# Altium schematic sheet Fastino.schdoc: Fastino v1.2
size 420 x 297 mm; EDA_Number: ARTIQ; Projet: Fastino; Author: G.Kasprowicz; CompanyName: WUT ISE; DrawnBy: G.Kasprowicz; Organization: WUT ISE; Address1: PW ISE; Address2: Nowowiejska 15/19 00-665 Warsaw; Address3: gkasprow@gmail.com; DocumentNumber: 1; Revision: 2; SheetNumber: 1; SheetTotal: 8; ModifiedBy: -; CheckedDate: -; Title2: Top; DivGrp: WUT ISE; Designer: G.Kasprowicz; ModifiedDate: -; ProjectName: Sensor Box
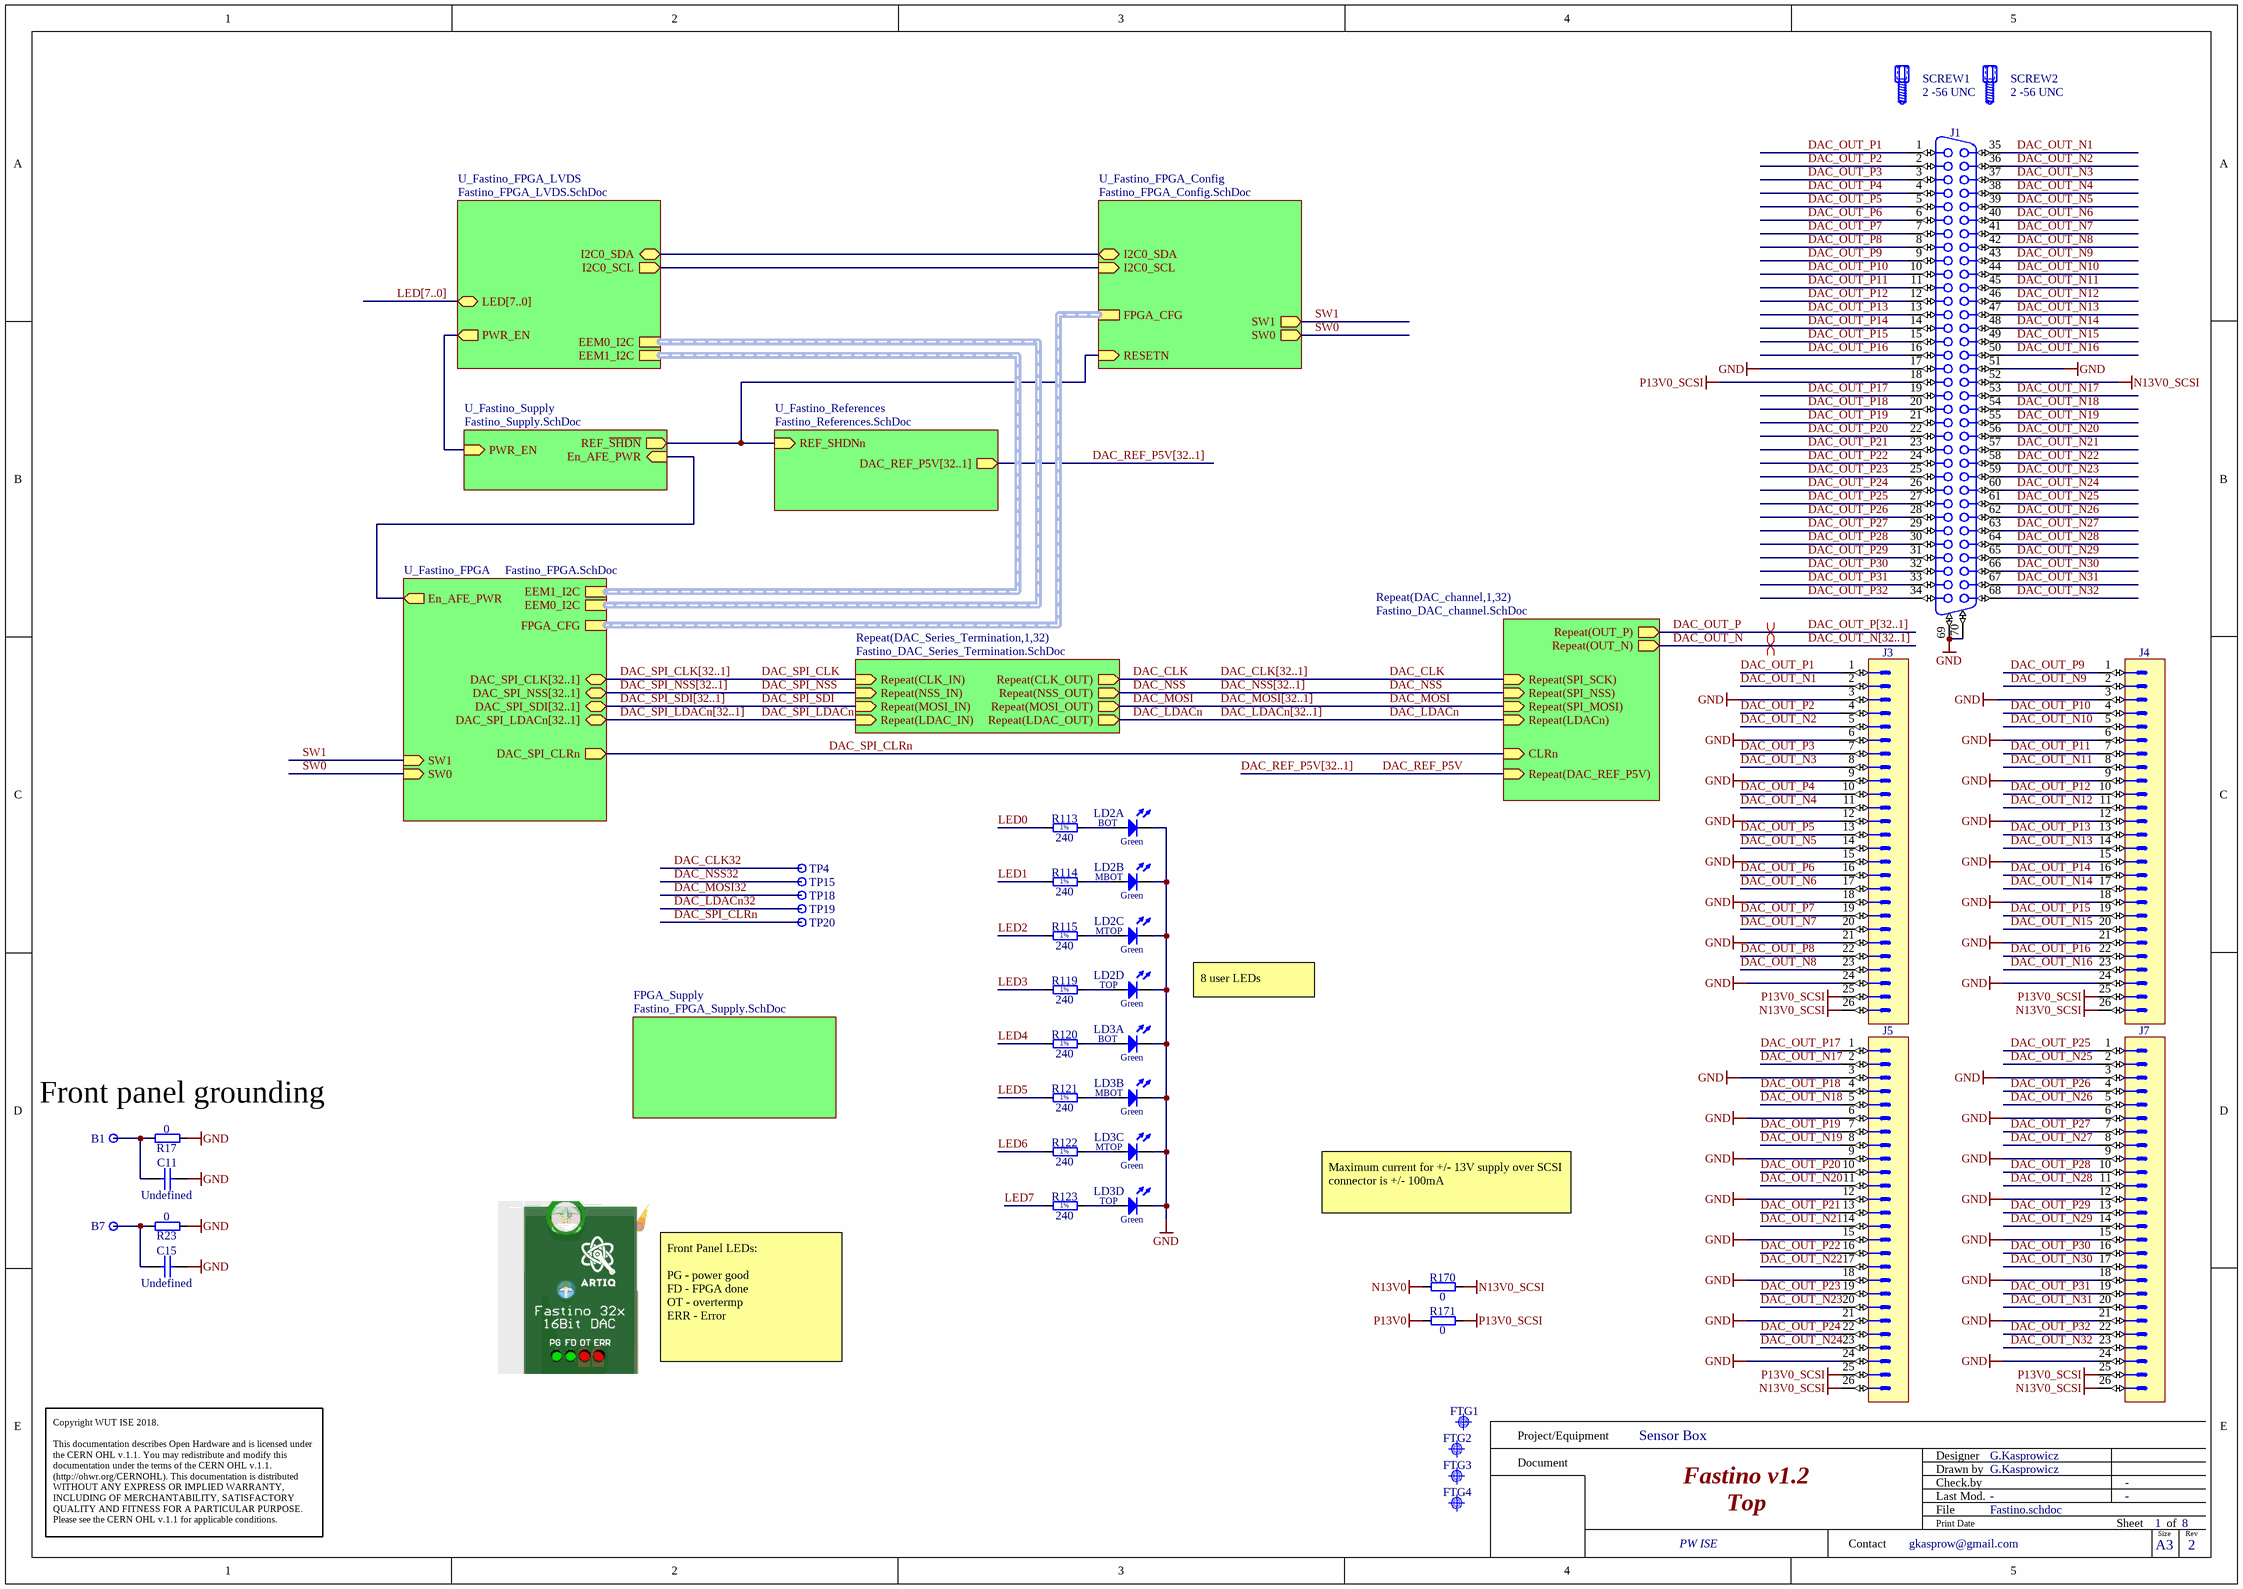
[diagram p0: Fastino.schdoc]

## Parts
B1  Plated Hole  [MTG270_500]  (value not drawn)
B7  Plated Hole  [MTG270_500]  (value not drawn)
C11  Undefined  [CAPC2012X135N]
C15  Undefined  [CAPC2012X135N]
FTG1  Use only in PCB  [FIDUCIAL_TOP_C100-200]  (value not drawn)
FTG2  Use only in PCB  [FIDUCIAL_TOP_S100-200]  (value not drawn)
FTG3  Use only in PCB  [FIDUCIAL_TOP_S100-200]  (value not drawn)
FTG4  Use only in PCB  [FIDUCIAL_TOP_S100-200]  (value not drawn)
J1  D-SUB  [TYCO_5787082-7]  (value not drawn)
J3  Header 26  [3M_N2526-6002RB]  (value not drawn)
J4  Header 26  [3M_N2526-6002RB]  (value not drawn)
J5  Header 26  [3M_N2526-6002RB]  (value not drawn)
J7  Header 26  [3M_N2526-6002RB]  (value not drawn)
LD2  Green  [LED_BIVAR_H485CGDL]  (value not drawn)  (parts A,B,C,D of 4)
LD3  Green  [LED_BIVAR_H485CGDL]  (value not drawn)  (parts A,B,C,D of 4)
R17  0  [RESC1608X55N]
R23  0  [RESC1608X55N]
R113  240  [RESC1608X55N]
R114  240  [RESC1608X55N]
R115  240  [RESC1608X55N]
R119  240  [RESC1608X55N]
R120  240  [RESC1608X55N]
R121  240  [RESC1608X55N]
R122  240  [RESC1608X55N]
R123  240  [RESC1608X55N]
R170  0  [RESC3216X65N]
R171  0  [RESC3216X65N]
SCREW1  2 -56 UNC  [TYCO_786585-2]
SCREW2  2 -56 UNC  [TYCO_786585-2]
TP4  Test Point  [TPS127]  (value not drawn)
TP15  Test Point  [TPS127]  (value not drawn)
TP18  Test Point  [TPS127]  (value not drawn)
TP19  Test Point  [TPS127]  (value not drawn)
TP20  Test Point  [TPS127]  (value not drawn)

## Sub-sheets
FPGA_Supply = Fastino_FPGA_Supply.SchDoc: no entries
Repeat(DAC_channel,1,32) = Fastino_DAC_channel.SchDoc: Repeat(OUT_P) (out), Repeat(OUT_N) (out), Repeat(SPI_SCK) (in), Repeat(SPI_NSS) (in), Repeat(SPI_MOSI) (in), CLRn (in), Repeat(LDACn) (in), Repeat(DAC_REF_P5V) (in)
Repeat(DAC_Series_Termination,1,32) = Fastino_DAC_Series_Termination.SchDoc: Repeat(CLK_IN) (in), Repeat(NSS_IN) (in), Repeat(MOSI_IN) (in), Repeat(LDAC_IN) (in), Repeat(CLK_OUT) (out), Repeat(NSS_OUT) (out), Repeat(LDAC_OUT) (out), Repeat(MOSI_OUT) (out)
U_Fastino_FPGA = Fastino_FPGA.SchDoc: DAC_SPI_LDACn[32..1] (bidir), DAC_SPI_SDI[32..1] (bidir), DAC_SPI_NSS[32..1] (bidir), DAC_SPI_CLRn (out), DAC_SPI_CLK[32..1] (bidir), FPGA_CFG (harness FPGA_CFG), SW1 (in), SW0 (in), EEM1_I2C (harness I2C), EEM0_I2C (harness I2C), En_AFE_PWR (out)
U_Fastino_FPGA_Config = Fastino_FPGA_Config.SchDoc: RESETN (in), FPGA_CFG (harness FPGA_CFG), SW1 (out), SW0 (out), I2C0_SCL (in), I2C0_SDA (bidir)
U_Fastino_FPGA_LVDS = Fastino_FPGA_LVDS.SchDoc: EEM0_I2C (harness I2C), EEM1_I2C (harness I2C), PWR_EN (out), LED[7..0] (bidir), I2C0_SDA (bidir), I2C0_SCL (out)
U_Fastino_References = Fastino_References.SchDoc: REF_SHDNn (in), DAC_REF_P5V[32..1] (out)
U_Fastino_Supply = Fastino_Supply.SchDoc: REF_~{SHDN} (out), PWR_EN (in), En_AFE_PWR (in)

## Nets
GND: C11.2 C15.2 J1.17 J1.51 J1.69 J1.70 J3.3 J3.6 J3.9 J3.12 J3.15 J3.18 J3.21 J3.24 J4.3 J4.6 J4.9 J4.12 J4.15 J4.18 J4.21 J4.24 J5.3 J5.6 J5.9 J5.12 J5.15 J5.18 J5.21 J5.24 J7.3 J7.6 J7.9 J7.12 J7.15 J7.18 J7.21 J7.24 LD2.1(C) LD2.3(C) LD2.5(C) LD2.7(C) LD3.1(C) LD3.3(C) LD3.5(C) LD3.7(C) R17.1 R23.1
N13V0: R170.1
N13V0_SCSI: J1.52 J3.26 J4.26 J5.26 J7.26 R170.2
P13V0: R171.1
P13V0_SCSI: J1.18 J3.25 J4.25 J5.25 J7.25 R171.2
DAC_CLK: sheet Repeat(DAC_channel,1,32)/Repeat(SPI_SCK), sheet Repeat(DAC_Series_Termination,1,32)/Repeat(CLK_OUT)
DAC_CLK32: TP4.1
DAC_LDACn: sheet Repeat(DAC_channel,1,32)/Repeat(LDACn), sheet Repeat(DAC_Series_Termination,1,32)/Repeat(LDAC_OUT)
DAC_LDACn32: TP19.1
DAC_MOSI: sheet Repeat(DAC_channel,1,32)/Repeat(SPI_MOSI), sheet Repeat(DAC_Series_Termination,1,32)/Repeat(MOSI_OUT)
DAC_MOSI32: TP18.1
DAC_NSS: sheet Repeat(DAC_channel,1,32)/Repeat(SPI_NSS), sheet Repeat(DAC_Series_Termination,1,32)/Repeat(NSS_OUT)
DAC_NSS32: TP15.1
DAC_OUT_N: sheet Repeat(DAC_channel,1,32)/Repeat(OUT_N)
DAC_OUT_N1: J1.35 J3.2
DAC_OUT_N2: J1.36 J3.5
DAC_OUT_N3: J1.37 J3.8
DAC_OUT_N4: J1.38 J3.11
DAC_OUT_N5: J1.39 J3.14
DAC_OUT_N6: J1.40 J3.17
DAC_OUT_N7: J1.41 J3.20
DAC_OUT_N8: J1.42 J3.23
DAC_OUT_N9: J1.43 J4.2
DAC_OUT_N10: J1.44 J4.5
DAC_OUT_N11: J1.45 J4.8
DAC_OUT_N12: J1.46 J4.11
DAC_OUT_N13: J1.47 J4.14
DAC_OUT_N14: J1.48 J4.17
DAC_OUT_N15: J1.49 J4.20
DAC_OUT_N16: J1.50 J4.23
DAC_OUT_N17: J1.53 J5.2
DAC_OUT_N18: J1.54 J5.5
DAC_OUT_N19: J1.55 J5.8
DAC_OUT_N20: J1.56 J5.11
DAC_OUT_N21: J1.57 J5.14
DAC_OUT_N22: J1.58 J5.17
DAC_OUT_N23: J1.59 J5.20
DAC_OUT_N24: J1.60 J5.23
DAC_OUT_N25: J1.61 J7.2
DAC_OUT_N26: J1.62 J7.5
DAC_OUT_N27: J1.63 J7.8
DAC_OUT_N28: J1.64 J7.11
DAC_OUT_N29: J1.65 J7.14
DAC_OUT_N30: J1.66 J7.17
DAC_OUT_N31: J1.67 J7.20
DAC_OUT_N32: J1.68 J7.23
DAC_OUT_P: sheet Repeat(DAC_channel,1,32)/Repeat(OUT_P)
DAC_OUT_P1: J1.1 J3.1
DAC_OUT_P2: J1.2 J3.4
DAC_OUT_P3: J1.3 J3.7
DAC_OUT_P4: J1.4 J3.10
DAC_OUT_P5: J1.5 J3.13
DAC_OUT_P6: J1.6 J3.16
DAC_OUT_P7: J1.7 J3.19
DAC_OUT_P8: J1.8 J3.22
DAC_OUT_P9: J1.9 J4.1
DAC_OUT_P10: J1.10 J4.4
DAC_OUT_P11: J1.11 J4.7
DAC_OUT_P12: J1.12 J4.10
DAC_OUT_P13: J1.13 J4.13
DAC_OUT_P14: J1.14 J4.16
DAC_OUT_P15: J1.15 J4.19
DAC_OUT_P16: J1.16 J4.22
DAC_OUT_P17: J1.19 J5.1
DAC_OUT_P18: J1.20 J5.4
DAC_OUT_P19: J1.21 J5.7
DAC_OUT_P20: J1.22 J5.10
DAC_OUT_P21: J1.23 J5.13
DAC_OUT_P22: J1.24 J5.16
DAC_OUT_P23: J1.25 J5.19
DAC_OUT_P24: J1.26 J5.22
DAC_OUT_P25: J1.27 J7.1
DAC_OUT_P26: J1.28 J7.4
DAC_OUT_P27: J1.29 J7.7
DAC_OUT_P28: J1.30 J7.10
DAC_OUT_P29: J1.31 J7.13
DAC_OUT_P30: J1.32 J7.16
DAC_OUT_P31: J1.33 J7.19
DAC_OUT_P32: J1.34 J7.22
DAC_REF_P5V: sheet Repeat(DAC_channel,1,32)/Repeat(DAC_REF_P5V)
DAC_SPI_CLK: sheet Repeat(DAC_Series_Termination,1,32)/Repeat(CLK_IN)
DAC_SPI_CLRn: TP20.1 ; sheet Repeat(DAC_channel,1,32)/CLRn, sheet U_Fastino_FPGA/DAC_SPI_CLRn
DAC_SPI_LDACn: sheet Repeat(DAC_Series_Termination,1,32)/Repeat(LDAC_IN)
DAC_SPI_NSS: sheet Repeat(DAC_Series_Termination,1,32)/Repeat(NSS_IN)
DAC_SPI_SDI: sheet Repeat(DAC_Series_Termination,1,32)/Repeat(MOSI_IN)
LED0: R113.1
LED1: R114.1
LED2: R115.1
LED3: R119.1
LED4: R120.1
LED5: R121.1
LED6: R122.1
LED7: R123.1
SW0: sheet U_Fastino_FPGA/SW0, sheet U_Fastino_FPGA_Config/SW0
SW1: sheet U_Fastino_FPGA/SW1, sheet U_Fastino_FPGA_Config/SW1
NetB1_1: B1.1 C11.1 R17.2
NetB7_1: B7.1 C15.1 R23.2
NetLD2_2: LD2.2(A) R113.2
NetLD2_4: LD2.4(A) R114.2
NetLD2_6: LD2.6(A) R115.2
NetLD2_8: LD2.8(A) R119.2
NetLD3_2: LD3.2(A) R120.2
NetLD3_4: LD3.4(A) R121.2
NetLD3_6: LD3.6(A) R122.2
NetLD3_8: LD3.8(A) R123.2
(unnamed): sheet U_Fastino_FPGA/En_AFE_PWR, sheet U_Fastino_Supply/En_AFE_PWR
(unnamed): sheet U_Fastino_FPGA_Config/RESETN, sheet U_Fastino_References/REF_SHDNn, sheet U_Fastino_Supply/REF_~{SHDN}
(unnamed): sheet U_Fastino_FPGA_Config/I2C0_SCL, sheet U_Fastino_FPGA_LVDS/I2C0_SCL
(unnamed): sheet U_Fastino_FPGA_Config/I2C0_SDA, sheet U_Fastino_FPGA_LVDS/I2C0_SDA
(unnamed): sheet U_Fastino_FPGA_LVDS/PWR_EN, sheet U_Fastino_Supply/PWR_EN

## Buses and harness runs
bus DAC_CLK[32..1]
bus DAC_LDACn[32..1]
bus DAC_MOSI[32..1]
bus DAC_NSS[32..1]
bus DAC_OUT_N[32..1]
bus DAC_OUT_P[32..1]
bus DAC_REF_P5V[32..1]
bus DAC_REF_P5V[32..1] = sheet U_Fastino_References/DAC_REF_P5V[32..1]
bus DAC_SPI_CLK[32..1] = sheet U_Fastino_FPGA/DAC_SPI_CLK[32..1]
bus DAC_SPI_LDACn[32..1] = sheet U_Fastino_FPGA/DAC_SPI_LDACn[32..1]
bus DAC_SPI_NSS[32..1] = sheet U_Fastino_FPGA/DAC_SPI_NSS[32..1]
bus DAC_SPI_SDI[32..1] = sheet U_Fastino_FPGA/DAC_SPI_SDI[32..1]
bus LED[7..0] = sheet U_Fastino_FPGA_LVDS/LED[7..0]
harness sheet U_Fastino_FPGA/EEM0_I2C = sheet U_Fastino_FPGA_LVDS/EEM0_I2C
harness sheet U_Fastino_FPGA/EEM1_I2C = sheet U_Fastino_FPGA_LVDS/EEM1_I2C
harness sheet U_Fastino_FPGA/FPGA_CFG = sheet U_Fastino_FPGA_Config/FPGA_CFG

## Layout directives
differential pair: DAC_OUT_N, DAC_OUT_P

## Notes on the sheet
- 8 user LEDs
- Front panel grounding
- Maximum current for +/- 13V supply over SCSI connector is +/- 100mA
- Front Panel LEDs:
  PG - power good
  FD - FPGA done
  OT - overtermp
  ERR - Error
- Project/Equipment
- Document
- Designer
- Drawn by
- Check.by
- Copyright WUT ISE 2018.
  This documentation describes Open Hardware and is licensed under the CERN OHL v.1.1. You may redistribute and modify this documentation under the terms of the CERN OHL v.1.1. (http://ohwr.org/CERNOHL). This documentation is distributed WITHOUT ANY EXPRESS OR IMPLIED WARRANTY, INCLUDING OF MERCHANTABILITY, SATISFACTORY QUALITY AND FITNESS FOR A PARTICULAR PURPOSE. Please see the CERN OHL v.1.1 for applicable conditions.
- Contact
- File
- Last Mod.
- Print Date
- Sheet
- Size
- A3
- of
- Rev
- (in symbol LED_BIVAR_H485CGDL, part A) BOT
- (in symbol LED_BIVAR_H485CGDL, part B) MBOT
- (in symbol LED_BIVAR_H485CGDL, part C) MTOP
- (in symbol LED_BIVAR_H485CGDL, part D) TOP
- (in symbol R0603_240R_1%_0.1W_100PPM) 1%

## Library data of the parts
B1 B7 = PLATED_HOLE2.7_PAD5.0: Single Terminal Socket; Part Description: Plated Through Hole: Hole Dia.=2.7mm Pad Dia.=5.0mm; Mounted: No; Part Number: PLATED_HOLE2.7_PAD5.0; Component Kind: Standard (No BOM); Component Type: Standard (No BOM); Pin Count: 1; Family: Plated Hole; Socket: No; SMD: No; Sense: No; Status: None; ComponentHeight: 0mm; HelpURL: Undefined; Author: CERN DEM JMW; CreateDate: 27.09.2011; LatestRevisionDate: 27.09.2011; PackageDescription: Plated Through Hole: Hole Dia.=2.7mm Pad Dia.=5.0mm
C11 C15 = CC0805_NO-VALUE: Non-polarised capacitor; Part Description: Reserved Footprint For 0805(2012) Chip Ceramic Capacitor; Mounted: No; Part Number: CC0805_NO-VALUE; Component Kind: Standard; Component Type: Standard; Pin Count: 2; Value: Undefined; Status: None; Manufacturer: Undefined; Manufacturer Part Number: CC0805_NO-VALUE; Case: 0805; Socket: No; SMD: Yes; Sense: No; Manufacturer1 ComponentHeight: 1.35mm; HelpURL: Undefined; Author: CERN DEM JLC; CreateDate: 10.12.2008; LatestRevisionDate: 11.09.2013
FTG1 = FIDUCIAL_TARGET_C100-200: Fiducial Target; Part Description: Round Fiducial Target, Top Layer, 1.0mm, Top Solder 2.0mm, Keepout =2.0mm; Mounted: No; Part Number: FIDUCIAL_TARGET_C100-200; Component Kind: Standard (No BOM); Component Type: Standard (No BOM); Pin Count: 1; Family: Fiducial; Socket: No; SMD: Yes; Sense: No; Status: None; ComponentHeight: 0mm; HelpURL: Undefined; Author: CERN DEM JLC; CreateDate: 09.02.2010; LatestRevisionDate: 04.04.2012; PackageDescription: Round Fiducial Target, Top Layer, 1.0mm, Top Solder 2.0mm, Keepout =2.0mm
FTG2-FTG4 = FIDUCIAL_TARGET_S100-200: Fiducial Target; Part Description: Square Fiducial Target, Top Layer, 1.0mm, Top Solder 2.0mm, Keepout =2.0mm; Mounted: No; Part Number: FIDUCIAL_TARGET_S100-200; Component Kind: Standard (No BOM); Component Type: Standard (No BOM); Pin Count: 1; Family: Fiducial; Socket: No; SMD: Yes; Sense: No; Status: None; ComponentHeight: 0mm; HelpURL: Undefined; Author: CERN DEM JLC; CreateDate: 09.02.2010; LatestRevisionDate: 04.04.2012; PackageDescription: Square Fiducial Target, Top Layer, 1.0mm, Top Solder 2.0mm, Keepout =2.0mm
J1 = TYCO_5787082-7: 68 contacts, AMPLIMITE .050", Right Angled Receptacle Series III; Manufacturer: TYCO ELECTRONICS; PressFit: No; Part Number: TYCO_5787082-7; Component Kind: Standard; Component Type: Standard; Pin Count: 70; Family: D-SUB; Mounted: Yes; Socket: No; SMD: No; Sense: No; Status: None; Part Description: 68 contacts, AMPLIMITE .050", Right Angled Receptacle Series III; Manufacturer Part Number: 5787082-7; ComponentHeight: 9.5mm; HelpURL: \\cern.ch\dfs\Applications\Altium\Datasheets\TYCO_5787082-7.pdf; Author: CERN DEM JLC; CreateDate: 13.03.2017; LatestRevisionDate: 13.03.2017
J3-J5 J7 = 3M_N2526-6002RB: Connector 26 Male; Part Description: 26 Contacts - Straight .100'' x .100'' Low Profile Four-Wall Header, 2500 Series; Manufacturer: 3M; PressFit: No; Part Number: 3M_N2526-6002RB; Component Kind: Standard; Component Type: Standard; Pin Count: 26; Family: Header 26; Mounted: Yes; Socket: No; SMD: No; Sense: No; Status: None; Manufacturer Part Number: N2526-6002RB; ComponentHeight: 10.03mm; HelpURL: \\cern.ch\dfs\Applications\Altium\Datasheets\3M_N2526-6002RB.pdf; Author: CERN DEM JLC; CreateDate: 11.02.2009; LatestRevisionDate: 11.08.2009
LD2 LD3 = LED_BIVAR_H485CGDL: LED x4 Green 1C2A-BOT_3C4A_5C6A_7C8A-TOP; Part Description: Quad-Level 2mm Green LED, PCB Edge Mounting; Manufacturer: BIVAR; PressFit: No; Bonding: No; Part Number: LED_BIVAR_H485CGDL; Component Kind: Standard; Component Type: Standard; Color: Green; PackageDescription: Quad-Level 2mm Green, PCB Edge Mounting  BIVAR H485CHDL; Manufacturer Part Number: H485CGDL; Pin Count: 8; Mounted: Yes; Socket: No; SMD: No; Sense: No; ComponentHeight: 11.3mm; HelpURL: \\cern.ch\dfs\Applications\Altium\Datasheets\LED_BIVAR_H485CGDL.pdf; Author: CERN DEM JLC; CreateDate: 04.06.2012; LatestRevisionDate: 04.06.2012
R17 R23 = R0603_0R_JUMPER: Resistor; Part Description: 1A (0.05R Max DC Resistance) Zero Ohm Jumper; Manufacturer: GENERIC; Manufacturer1 Part Number: NRC06Z0; PressFit: No; Part Number: R0603_0R_JUMPER; Component Kind: Standard; Component Type: Standard; Pin Count: 2; Value: 0; Status: Preferred; Manufacturer Part Number: R0603_0R_JUMPER; Case: 0603; Mounted: Yes; Sense: No; Socket: No; SMD: Yes; Manufacturer1 Example: NIC COMPONENT; Manufacturer1 ComponentHeight: 0.55mm; HelpURL: \\cern.ch\dfs\Applications\Altium\Datasheets\R0603_NIC_NRC.pdf; Author: CERN DEM JLC; CreateDate: 03.12.2007; LatestRevisionDate: 13.03.2008
R113-R115 R119-R123 = R0603_240R_1%_0.1W_100PPM: Resistor - 1%; Part Description: General Purpose Thick Film Chip Resistor; Manufacturer: GENERIC; Manufacturer1 Part Number: NRC06F2400TRF; Power: 0.1W; TC: ±100ppm/°C; PressFit: No; Part Number: R0603_240R_1%_0.1W_100PPM; Component Kind: Standard; Component Type: Standard; Pin Count: 2; Value: 240; Status: Preferred; Tolerance: ±1%; Manufacturer Part Number: R0603_240R_1%_0.1W_100PPM; Case: 0603; Mounted: Yes; Sense: No; Socket: No; SMD: Yes; Manufacturer1 Example: NIC COMPONENT; Manufacturer1 ComponentHeight: 0.55mm; HelpURL: \\cern.ch\dfs\Applications\Altium\Datasheets\R0603_NIC_NRC.pdf; Author: CERN DEM JLC; CreateDate: 03.12.2007; LatestRevisionDate: 13.03.2008
R170 R171 = R1206_0R_Jumper: Resistor; Part Description: 2A (0.05R Max DC Resistance) Zero Ohm Jumper; Manufacturer: GENERIC; Manufacturer1 Part Number: NRC12Z0; PressFit: No; Part Number: R1206_0R_JUMPER; Component Kind: Standard; Component Type: Standard; Pin Count: 2; Value: 0; Status: Preferred; Manufacturer Part Number: R1206_0R_JUMPER; Case: 1206; Mounted: Yes; Sense: No; Socket: No; SMD: Yes; Manufacturer1 Example: NIC COMPONENT; Manufacturer1 ComponentHeight: 0.65mm; HelpURL: \\cern.ch\dfs\Applications\Altium\Datasheets\R1206_NIC_NRC.pdf; Author: CERN DEM JLC; CreateDate: 03.12.2007; LatestRevisionDate: 13.03.2008
SCREW1 SCREW2 = MECH_Tyco_SCSI_Screwlock: SCSI Screw Lock; Part Description: 50SR SCREWLOCK KIT, FEMALE; Manufacturer: TYCO ELECTRONICS; Manufacturer Part Number: 786585-2; PressFit: No; Part Number: TYCO_786585-2; Component Kind: Standard; Component Type: Mechanical; Pin Count: 0; PackageDescription: 50SR SCREWLOCK KIT, FEMALE; Mounted: Yes; Socket: No; SMD: No; Sense: No; Status: None; Value: 2 -56 UNC; ComponentHeight: 9.02mm; Author: GK; CreateDate: 10.09.2013; LatestRevisionDate: 10.09.2013
TP4 TP15 TP18-TP20 = SMD_PAD_1.27X1.27MM: Part Description: 1.27mm x 1.27mm PCB Copper Area (SMD Test Point); Mounted: No; Part Number: SMD_PAD_1.27X1.27MM; Component Kind: Standard (No BOM); Component Type: Standard (No BOM); Pin Count: 1; Family: Test Point; Socket: No; SMD: No; Sense: No; Status: None; ComponentHeight: 0mm; HelpURL: Undefined; Author: CERN DEM JLC; CreateDate: 12.01.2008; LatestRevisionDate: 12.01.2008; PackageDescription: 1.27mm x 1.27mm PCB Copper Area (SMD Test Point)